# Altium schematic sheet 5.8FEM.SchDoc
size A4
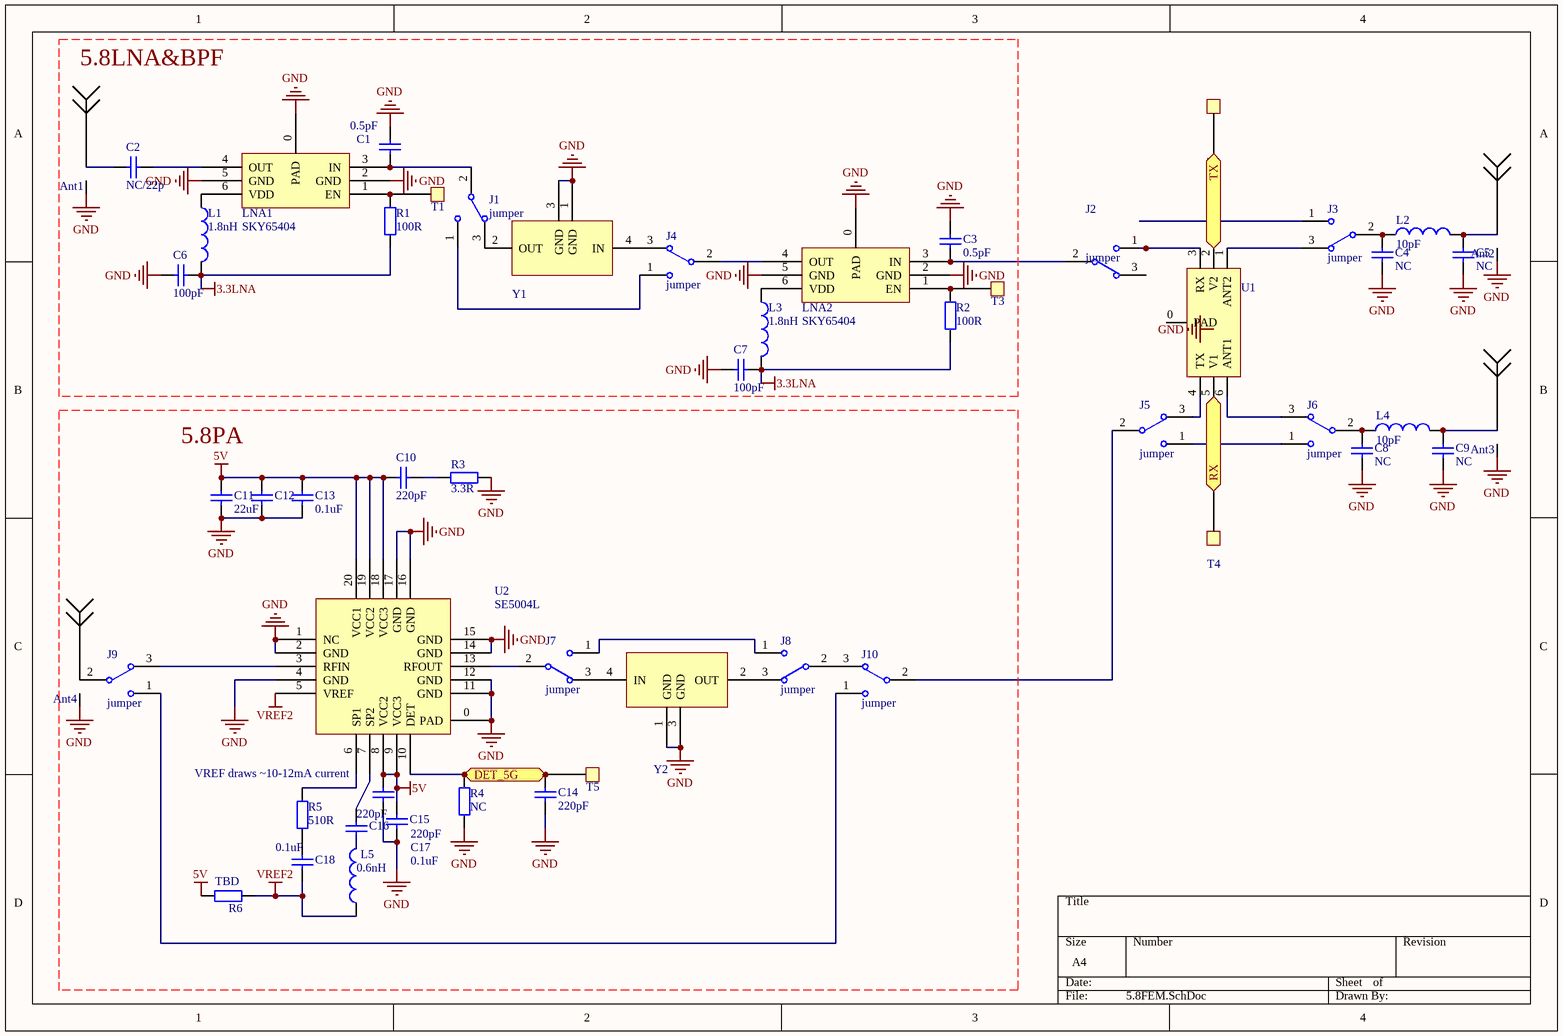
[diagram p0: 5.8FEM.SchDoc]

## Parts
Ant1  Antenna  [SMA-2]  (value not drawn)
Ant2  Antenna  [SMA-2]  (value not drawn)
Ant3  Antenna  [SMA-2]  (value not drawn)
Ant4  Antenna  [SMA-2]  (value not drawn)
C1  value 0.5pF  [0402]  (hidden comment: Cap)
C2  NC/22p  [0402]
C3  value 0.5pF  [0402]  (hidden comment: Cap)
C4  value NC  [0402]  (hidden comment: Cap)
C5  value NC  [0402]  (hidden comment: Cap)
C6  value 100pF  [0402]  (hidden comment: Cap)
C7  value 100pF  [0402]  (hidden comment: Cap)
C8  value NC  [0402]  (hidden comment: Cap)
C9  value NC  [0402]  (hidden comment: Cap)
C10  value 220pF  [0402]  (hidden comment: Cap)
C11  value 22uF  [0805]  (hidden comment: Cap)
C12  1uF  [0603]  (value not drawn)
C13  value 0.1uF  [0402]  (hidden comment: Cap)
C14  value 220pF  [0402]  (hidden comment: Cap)
C15  value 0.1uF  [0402]  (hidden comment: Cap)
C16  value 220pF  [0402]  (hidden comment: Cap)
C17  value 220pF  [0402]  (hidden comment: Cap)
C18  value 0.1uF  [0402]  (hidden comment: Cap)
J1  jumper  [0402J]
J2  jumper  [0402J]
J3  jumper  [0402J]
J4  jumper  [0402J]
J5  jumper  [0402J]
J6  jumper  [0402J]
J7  jumper  [0402J]
J8  jumper  [0402J]
J9  jumper  [0402J]
J10  jumper  [0402J]
L1  value 1.8nH  [0402]  (hidden comment: Inductor)
L2  value 10pF  [0402]  (hidden comment: Inductor)
L3  value 1.8nH  [0402]  (hidden comment: Inductor)
L4  value 10pF  [0402]  (hidden comment: Inductor)
L5  value 0.6nH  [0402]  (hidden comment: Inductor)
LNA1  SKY65404  [SKY65404-31]
LNA2  SKY65404  [SKY65404-31]
R1  value 100R  [0402]  (hidden comment: Res2)
R2  value 100R  [0402]  (hidden comment: Res2)
R3  value 3.3R  [0402]  (hidden comment: Res2)
R4  value NC  [0402]  (hidden comment: Res2)
R5  value 510R  [0402]  (hidden comment: Res2)
R6  TBD  [0603]
T1  TestPad  [TestPad - 1mm]  (value not drawn)
T2  TestPad  [TestPad - 1mm]  (value not drawn)
T3  TestPad  [TestPad - 1mm]  (value not drawn)
T4  TestPad  [TestPad - 1mm]  (value not drawn)
T5  TestPad  [TestPad - 1mm]  (value not drawn)
U1  SKY13411  [SKY65404-31]  (value not drawn)
U2  SE5004L  [SE5004L]
Y1  2450BP39C100A  [2450BP39C100A]  (value not drawn)
Y2  2450BP39C100A  [2450BP39C100A]  (value not drawn)

## Ports
DET_5G, RX, TX

## Nets
3.3LNA: C6.2 C7.2 L1.2 L3.2 R1.2 R2.2
5V: C10.2 C11.2 C12.1 C13.1 C15.2 C17.2 R6.2 U2.8(VCC2) U2.9(VCC3) U2.18(VCC3) U2.19(VCC2) U2.20(VCC1)
GND: Ant1.GND(G) Ant2.GND(G) Ant3.GND(G) Ant4.GND(G) C1.1 C3.1 C4.1 C5.1 C6.1 C7.1 C8.1 C9.1 C11.1 C12.2 C13.2 C14.2 C15.1 C17.1 LNA1.0(PAD) LNA1.2(GND) LNA1.5(GND) LNA2.0(PAD) LNA2.2(GND) LNA2.5(GND) R3.1 R4.1 U2.0(PAD) U2.1(NC) U2.2(GND) U2.4(GND) U2.11(GND) U2.12(GND) U2.14(GND) U2.15(GND) U2.16(GND) U2.17(GND) Y1.1(GND) Y1.3(GND) Y2.1(GND) Y2.3(GND)
VREF2: C18.1 L5.1 R6.1 U2.5(VREF)
DET_5G: C14.1 R4.2 T5.1 U2.10(DET) ; port DET_5G
RX: T4.1 U1.5(V1) ; port RX
TX: T2.1 U1.2(V2) ; port TX
NetAnt1_1: Ant1.1 C2.1
NetAnt2_1: Ant2.1 C5.2 L2.2
NetAnt3_1: Ant3.1 C9.2 L4.2
NetAnt4_1: Ant4.1 J9.2
NetC1_2: C1.2 J1.2 LNA1.3(IN)
NetC2_2: C2.2 LNA1.4(OUT)
NetC3_2: C3.2 J2.2 LNA2.3(IN)
NetC4_2: C4.2 J3.2 L2.1
NetC8_2: C8.2 J6.2 L4.1
NetC10_1: C10.1 R3.2
NetC16_1: C16.1 L5.2
NetC16_2: C16.2 U2.7(SP2)
NetC18_2: C18.2 R5.1
NetJ1_1: J1.1 J4.1
NetJ1_3: J1.3 Y1.2(OUT)
NetJ2_1: J2.1 U1.3(RX)
NetJ3_3: J3.3 U1.1(ANT2)
NetJ4_2: J4.2 LNA2.4(OUT)
NetJ4_3: J4.3 Y1.4(IN)
NetJ5_1: J5.1 J6.1
NetJ5_2: J5.2 J10.2
NetJ5_3: J5.3 U1.4(TX)
NetJ6_3: J6.3 U1.6(ANT1)
NetJ7_1: J7.1 J8.1
NetJ7_2: J7.2 U2.13(RFOUT)
NetJ7_3: J7.3 Y2.4(IN)
NetJ8_2: J8.2 J10.3
NetJ8_3: J8.3 Y2.2(OUT)
NetJ9_1: J9.1 J10.1
NetJ9_3: J9.3 U2.3(RFIN)
NetL1_1: L1.1 LNA1.6(VDD)
NetL3_1: L3.1 LNA2.6(VDD)
NetLNA1_1: LNA1.1(EN) R1.1 T1.1
NetLNA2_1: LNA2.1(EN) R2.1 T3.1
NetR5_2: R5.2 U2.6(SP1)

Not connected (* = marked no-connect by the designer): J2 3; J3 1; U1 0(PAD)

## Notes on the sheet
- 5.8LNA&BPF
- 5.8PA
- VREF draws ~10-12mA current
- Labels drawn without touching a wire or pin: GND

## Library data of the parts
C1-C18 = Cap: Capacitor; Published: 8-Jun-2000; LatestRevisionDate: 17-Jul-2002; LatestRevisionNote: Re-released for DXP Platform.; PackageReference: RAD-0.3; Publisher: Altium Limited; PackageDescription: Radial Cap, Thru-Hole; 2 Leads; 0.3 in Pin Spacing
J1-J10 = SW-SPDT: SPDT Subminiature Toggle Switch, Right Angle Mounting, Vertical Actuation; Published: 24-Mar-1999; LatestRevisionDate: 17-Dec-2003; LatestRevisionNote: Schematic revised, PCB Footprint replaced.; DatasheetVersion: 05-Dec-2000; PackageReference: TL36WW15050; Publisher: Altium Limited; PackageDescription: Switch; 4 Leads; ComponentLink1Description: Manufacturer Link; ComponentLink1URL: http://www.apem.com
L1-L5 = Inductor: Code_IEC: 1005; Published: 8-Jun-2000; LatestRevisionDate: 29-May-2009; LatestRevisionNote: IPC-7351 Footprint Added.; PackageReference: 0402-A; Publisher: Altium Limited; PackageDescription: Chip Inductor; Code_JEITA: 0402
LNA1 LNA2 = SKY65404-31
R1-R6 = Res2: Resistor; Published: 8-Jun-2000; LatestRevisionDate: 17-Jul-2002; LatestRevisionNote: Re-released for DXP Platform.; PackageReference: AXIAL-0.4; Publisher: Altium Limited; PackageDescription: Axial Device, Thru-Hole; 2 Leads; 0.4 in Pin Spacing